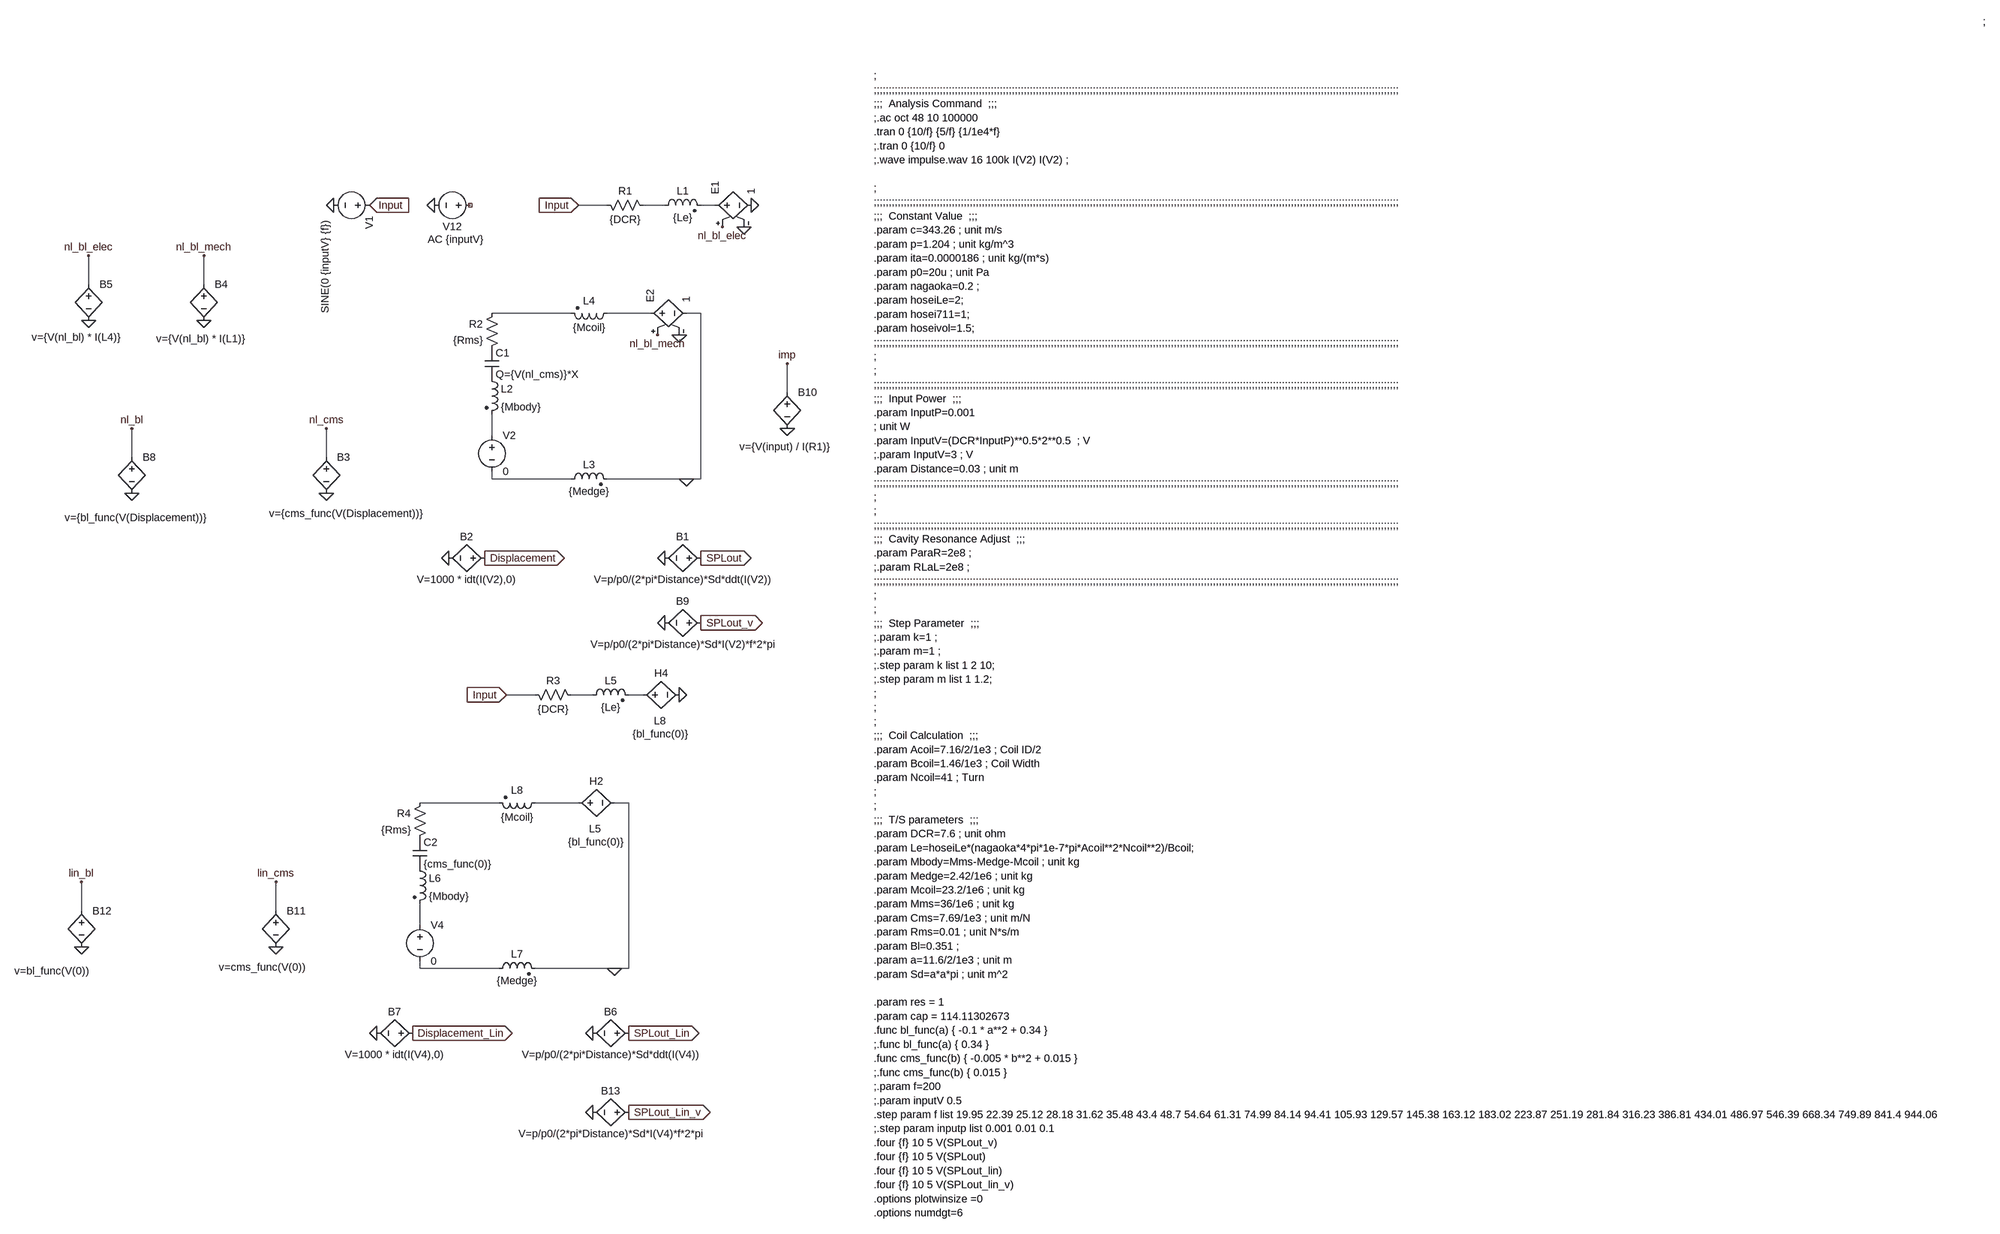
[diagram p0: schematic demo_11_01mw.asc]
demo_11_01mw.asc, the LTspice schematic file:
Version 4
SHEET 1 6896 9720
WIRE -2672 -416 -2736 -416
WIRE -2544 -416 -2592 -416
WIRE -2432 -416 -2464 -416
WIRE -3824 -240 -3824 -304
WIRE -3568 -240 -3568 -304
WIRE -2752 -176 -2928 -176
WIRE -2576 -176 -2672 -176
WIRE -2464 -176 -2496 -176
WIRE -2272 0 -2272 -64
WIRE -2928 96 -2928 48
WIRE -3728 144 -3728 80
WIRE -3296 144 -3296 80
WIRE -2928 192 -2928 176
WIRE -2752 192 -2928 192
WIRE -2496 192 -2672 192
WIRE -2464 192 -2464 -176
WIRE -2464 192 -2496 192
WIRE -2832 672 -2896 672
WIRE -2704 672 -2752 672
WIRE -2592 672 -2624 672
WIRE -2912 912 -3088 912
WIRE -2736 912 -2832 912
WIRE -2624 912 -2656 912
WIRE -3840 1152 -3840 1088
WIRE -3408 1152 -3408 1088
WIRE -3088 1184 -3088 1136
WIRE -3088 1280 -3088 1264
WIRE -2912 1280 -3088 1280
WIRE -2656 1280 -2832 1280
WIRE -2624 1280 -2624 912
WIRE -2624 1280 -2656 1280
FLAG -3056 -416 0
FLAG -3200 -416 Input
IOPIN -3200 -416 In
FLAG -2352 -416 0
FLAG -2736 -416 Input
IOPIN -2736 -416 In
FLAG -2496 192 0
FLAG -2464 368 SPLout
IOPIN -2464 368 Out
FLAG -2544 368 0
FLAG -2944 368 Displacement
IOPIN -2944 368 Out
FLAG -3024 368 0
FLAG -3280 -416 0
FLAG -3296 224 0
FLAG -3296 80 nl_cms
FLAG -3568 -160 0
FLAG -3568 -304 nl_bl_mech
FLAG -3824 -160 0
FLAG -3824 -304 nl_bl_elec
FLAG -2416 -368 nl_bl_elec
FLAG -2560 -128 nl_bl_mech
FLAG -2512 -128 0
FLAG -2368 -368 0
FLAG -2512 672 0
FLAG -2896 672 Input
IOPIN -2896 672 In
FLAG -2656 1280 0
FLAG -2624 1424 SPLout_Lin
IOPIN -2624 1424 Out
FLAG -2704 1424 0
FLAG -3104 1424 Displacement_Lin
IOPIN -3104 1424 Out
FLAG -3184 1424 0
FLAG -3728 224 0
FLAG -3728 80 nl_bl
FLAG -2464 512 SPLout_v
IOPIN -2464 512 Out
FLAG -2544 512 0
FLAG -2272 80 0
FLAG -2272 -64 imp
FLAG -3408 1232 0
FLAG -3408 1088 lin_cms
FLAG -3840 1232 0
FLAG -3840 1088 lin_bl
FLAG -2624 1600 SPLout_Lin_v
IOPIN -2624 1600 Out
FLAG -2704 1600 0
SYMBOL voltage -2960 -416 R90
WINDOW 0 32 56 VTop 2
WINDOW 3 -32 56 VBottom 2
WINDOW 123 60 48 VTop 2
SYMATTR InstName V12
SYMATTR Value ""
SYMATTR Value2 AC {inputV}
SYMBOL res -2688 -432 M90
WINDOW 0 0 56 VBottom 2
WINDOW 3 32 56 VTop 2
SYMATTR InstName R1
SYMATTR Value {DCR}
SYMBOL ind2 -2560 -400 R270
WINDOW 0 32 56 VTop 2
WINDOW 3 4 56 VBottom 2
SYMATTR InstName L1
SYMATTR Value {Le}
SYMATTR Type ind
SYMBOL res -2912 -192 M0
SYMATTR InstName R2
SYMATTR Value {Rms}
SYMBOL cap -2944 -96 R0
SYMATTR InstName C1
SYMATTR Value Q={V(nl_cms)}*X
SYMBOL h -2752 912 R270
WINDOW 0 32 56 VTop 2
WINDOW 3 -71 55 VBottom 2
WINDOW 38 -42 53 VBottom 2
SYMATTR InstName H2
SYMATTR Value {bl_func(0)}
SYMATTR SpiceModel L5
SYMBOL ind2 -2944 -48 R0
SYMATTR InstName L2
SYMATTR Value {Mbody}
SYMBOL voltage -2928 80 R0
SYMATTR InstName V2
SYMATTR Value 0
SYMBOL ind2 -2768 208 R270
WINDOW 0 32 56 VTop 2
WINDOW 3 4 56 VBottom 2
SYMATTR InstName L3
SYMATTR Value {Medge}
SYMBOL ind2 -2656 -192 R90
WINDOW 0 4 56 VBottom 2
WINDOW 3 32 56 VTop 2
SYMATTR InstName L4
SYMATTR Value {Mcoil}
SYMBOL bv -2448 368 R90
WINDOW 0 -32 56 VBottom 2
WINDOW 3 32 56 VTop 2
SYMATTR InstName B1
SYMATTR Value V=p/p0/(2*pi*Distance)*Sd*ddt(I(V2))
SYMBOL bv -2928 368 R90
WINDOW 0 -32 56 VBottom 2
WINDOW 3 32 56 VTop 2
SYMATTR InstName B2
SYMATTR Value V=1000 * idt(I(V2),0)
SYMBOL h -2608 672 R270
WINDOW 0 32 56 VTop 2
WINDOW 3 -71 55 VBottom 2
WINDOW 38 -42 53 VBottom 2
SYMATTR InstName H4
SYMATTR Value {bl_func(0)}
SYMATTR SpiceModel L8
SYMBOL voltage -3184 -416 R90
WINDOW 3 33 114 Left 2
WINDOW 123 24 38 Left 2
SYMATTR Value SINE(0 {inputV} {f})
SYMATTR InstName V1
SYMBOL bv -3296 128 R0
WINDOW 3 -127 141 Left 2
SYMATTR Value v={cms_func(V(Displacement))}
SYMATTR InstName B3
SYMBOL bv -3568 -256 R0
WINDOW 3 -106 137 Left 2
SYMATTR Value v={V(nl_bl) * I(L1)}
SYMATTR InstName B4
SYMBOL bv -3824 -256 R0
WINDOW 3 -127 133 Left 2
SYMATTR Value v={V(nl_bl) * I(L4)}
SYMATTR InstName B5
SYMBOL e -2448 -416 R270
SYMATTR InstName E1
SYMATTR Value 1
SYMBOL e -2592 -176 R270
SYMATTR InstName E2
SYMATTR Value 1
SYMBOL res -2848 656 M90
WINDOW 0 0 56 VBottom 2
WINDOW 3 32 56 VTop 2
SYMATTR InstName R3
SYMATTR Value {DCR}
SYMBOL ind2 -2720 688 R270
WINDOW 0 32 56 VTop 2
WINDOW 3 4 56 VBottom 2
SYMATTR InstName L5
SYMATTR Value {Le}
SYMATTR Type ind
SYMBOL res -3072 896 M0
SYMATTR InstName R4
SYMATTR Value {Rms}
SYMBOL cap -3104 992 R0
SYMATTR InstName C2
SYMATTR Value {cms_func(0)}
SYMBOL ind2 -3104 1040 R0
SYMATTR InstName L6
SYMATTR Value {Mbody}
SYMBOL voltage -3088 1168 R0
SYMATTR InstName V4
SYMATTR Value 0
SYMBOL ind2 -2928 1296 R270
WINDOW 0 32 56 VTop 2
WINDOW 3 4 56 VBottom 2
SYMATTR InstName L7
SYMATTR Value {Medge}
SYMBOL ind2 -2816 896 R90
WINDOW 0 4 56 VBottom 2
WINDOW 3 32 56 VTop 2
SYMATTR InstName L8
SYMATTR Value {Mcoil}
SYMBOL bv -2608 1424 R90
WINDOW 0 -32 56 VBottom 2
WINDOW 3 32 56 VTop 2
SYMATTR InstName B6
SYMATTR Value V=p/p0/(2*pi*Distance)*Sd*ddt(I(V4))
SYMBOL bv -3088 1424 R90
WINDOW 0 -32 56 VBottom 2
WINDOW 3 32 56 VTop 2
SYMATTR InstName B7
SYMATTR Value V=1000 * idt(I(V4),0)
SYMBOL bv -3728 128 R0
WINDOW 3 -149 150 Left 2
SYMATTR Value v={bl_func(V(Displacement))}
SYMATTR InstName B8
SYMBOL bv -2448 512 R90
WINDOW 0 -32 56 VBottom 2
WINDOW 3 32 56 VTop 2
SYMATTR InstName B9
SYMATTR Value V=p/p0/(2*pi*Distance)*Sd*I(V2)*f*2*pi
SYMBOL bv -2272 -16 R0
WINDOW 3 -106 137 Left 2
SYMATTR Value v={V(input) / I(R1)}
SYMATTR InstName B10
SYMBOL bv -3408 1136 R0
WINDOW 3 -127 141 Left 2
SYMATTR Value v=cms_func(V(0))
SYMATTR InstName B11
SYMBOL bv -3840 1136 R0
WINDOW 3 -149 150 Left 2
SYMATTR Value v=bl_func(V(0))
SYMATTR InstName B12
SYMBOL bv -2608 1600 R90
WINDOW 0 -32 56 VBottom 2
WINDOW 3 32 56 VTop 2
SYMATTR InstName B13
SYMATTR Value V=p/p0/(2*pi*Distance)*Sd*I(V4)*f*2*pi
TEXT -2080 -704 Left 2 !;\n;;;;;;;;;;;;;;;;;;;;;;;;;;;;;;;;;;;;;;;;;;;;;;;;;;;;;;;;;;;;;;;;;;;;;;;;;;;;;;;;;;;;;;;;;;;;;;;;;;;;;;;;;;;;;;;;;;;;;;;;;;;;;;;;;;;;;;;;;;;;;;;;;;;;;;;;;;;;;;;;;;;;;;;;;;;;;;;\n;;;  Analysis Command  ;;;\n;.ac oct 48 10 100000\n.tran 0 {10/f} {5/f} {1/1e4*f}\n;.tran 0 {10/f} 0\n;.wave impulse.wav 16 100k I(V2) I(V2) ;\n \n;\n;;;;;;;;;;;;;;;;;;;;;;;;;;;;;;;;;;;;;;;;;;;;;;;;;;;;;;;;;;;;;;;;;;;;;;;;;;;;;;;;;;;;;;;;;;;;;;;;;;;;;;;;;;;;;;;;;;;;;;;;;;;;;;;;;;;;;;;;;;;;;;;;;;;;;;;;;;;;;;;;;;;;;;;;;;;;;;;\n;;;  Constant Value  ;;;\n.param c=343.26 ; unit m/s\n.param p=1.204 ; unit kg/m^3\n.param ita=0.0000186 ; unit kg/(m*s)\n.param p0=20u ; unit Pa\n.param nagaoka=0.2 ; \n.param hoseiLe=2;\n.param hosei711=1;\n.param hoseivol=1.5;\n;;;;;;;;;;;;;;;;;;;;;;;;;;;;;;;;;;;;;;;;;;;;;;;;;;;;;;;;;;;;;;;;;;;;;;;;;;;;;;;;;;;;;;;;;;;;;;;;;;;;;;;;;;;;;;;;;;;;;;;;;;;;;;;;;;;;;;;;;;;;;;;;;;;;;;;;;;;;;;;;;;;;;;;;;;;;;;;\n;\n;\n;;;;;;;;;;;;;;;;;;;;;;;;;;;;;;;;;;;;;;;;;;;;;;;;;;;;;;;;;;;;;;;;;;;;;;;;;;;;;;;;;;;;;;;;;;;;;;;;;;;;;;;;;;;;;;;;;;;;;;;;;;;;;;;;;;;;;;;;;;;;;;;;;;;;;;;;;;;;;;;;;;;;;;;;;;;;;;;\n;;;  Input Power  ;;;\n.param InputP=0.001 \n; unit W\n.param InputV=(DCR*InputP)**0.5*2**0.5  ; V\n;.param InputV=3 ; V\n.param Distance=0.03 ; unit m\n;;;;;;;;;;;;;;;;;;;;;;;;;;;;;;;;;;;;;;;;;;;;;;;;;;;;;;;;;;;;;;;;;;;;;;;;;;;;;;;;;;;;;;;;;;;;;;;;;;;;;;;;;;;;;;;;;;;;;;;;;;;;;;;;;;;;;;;;;;;;;;;;;;;;;;;;;;;;;;;;;;;;;;;;;;;;;;;\n;\n;\n;;;;;;;;;;;;;;;;;;;;;;;;;;;;;;;;;;;;;;;;;;;;;;;;;;;;;;;;;;;;;;;;;;;;;;;;;;;;;;;;;;;;;;;;;;;;;;;;;;;;;;;;;;;;;;;;;;;;;;;;;;;;;;;;;;;;;;;;;;;;;;;;;;;;;;;;;;;;;;;;;;;;;;;;;;;;;;;\n;;;  Cavity Resonance Adjust  ;;;\n.param ParaR=2e8 ;\n;.param RLaL=2e8 ;\n;;;;;;;;;;;;;;;;;;;;;;;;;;;;;;;;;;;;;;;;;;;;;;;;;;;;;;;;;;;;;;;;;;;;;;;;;;;;;;;;;;;;;;;;;;;;;;;;;;;;;;;;;;;;;;;;;;;;;;;;;;;;;;;;;;;;;;;;;;;;;;;;;;;;;;;;;;;;;;;;;;;;;;;;;;;;;;;\n;\n;\n;;;  Step Parameter  ;;;\n;.param k=1 ;\n;.param m=1 ;\n;.step param k list 1 2 10;\n;.step param m list 1 1.2;\n;\n;\n;\n;;;  Coil Calculation  ;;;\n.param Acoil=7.16/2/1e3 ; Coil ID/2\n.param Bcoil=1.46/1e3 ; Coil Width\n.param Ncoil=41 ; Turn\n;\n;\n;;;  T/S parameters  ;;;\n.param DCR=7.6 ; unit ohm\n.param Le=hoseiLe*(nagaoka*4*pi*1e-7*pi*Acoil**2*Ncoil**2)/Bcoil; \n.param Mbody=Mms-Medge-Mcoil ; unit kg\n.param Medge=2.42/1e6 ; unit kg\n.param Mcoil=23.2/1e6 ; unit kg\n.param Mms=36/1e6 ; unit kg\n.param Cms=7.69/1e3 ; unit m/N\n.param Rms=0.01 ; unit N*s/m\n.param Bl=0.351 ;\n.param a=11.6/2/1e3 ; unit m\n.param Sd=a*a*pi ; unit m^2\n \n.param res = 1\n.param cap = 114.11302673\n.func bl_func(a) { -0.1 * a**2 + 0.34 }\n;.func bl_func(a) { 0.34 }\n.func cms_func(b) { -0.005 * b**2 + 0.015 }\n;.func cms_func(b) { 0.015 }\n;.param f=200\n;.param inputV 0.5\n.step param f list 19.95 22.39 25.12 28.18 31.62 35.48 43.4 48.7 54.64 61.31 74.99 84.14 94.41 105.93 129.57 145.38 163.12 183.02 223.87 251.19 281.84 316.23 386.81 434.01 486.97 546.39 668.34 749.89 841.4 944.06\n;.step param inputp list 0.001 0.01 0.1\n.four {f} 10 5 V(SPLout_v)\n.four {f} 10 5 V(SPLout)\n.four {f} 10 5 V(SPLout_lin)\n.four {f} 10 5 V(SPLout_lin_v) \n.options plotwinsize =0\n.options numdgt=6
TEXT 2064 -1288 Left 2 !;

The netlist it stands for:
* demo_11_01mw.asc
V12 NC_01 0 AC {inputV}
R1 Input N001 {DCR}
L1 N001 N002 {Le}
R2 N003 P001 {Rms}
C1 P001 P002 Q={V(nl_cms)}*X
H2 N010 0 L5 {bl_func(0)}
L2 P002 N005 {Mbody}
V2 N005 N006 0
L3 N006 0 {Medge}
L4 N004 N003 {Mcoil}
B1 SPLout 0 V=p/p0/(2*pi*Distance)*Sd*ddt(I(V2))
B2 Displacement 0 V=1000 * idt(I(V2),0)
H4 N008 0 L8 {bl_func(0)}
V1 Input 0 SINE(0 {inputV} {f})
B3 nl_cms 0 v={cms_func(V(Displacement))}
B4 nl_bl_mech 0 v={V(nl_bl) * I(L1)}
B5 nl_bl_elec 0 v={V(nl_bl) * I(L4)}
E1 N002 0 nl_bl_elec 0 1
E2 N004 0 nl_bl_mech 0 1
R3 Input N007 {DCR}
L5 N007 N008 {Le}
R4 N009 P003 {Rms}
C2 P003 P004 {cms_func(0)}
L6 P004 N011 {Mbody}
V4 N011 N012 0
L7 N012 0 {Medge}
L8 N010 N009 {Mcoil}
B6 SPLout_Lin 0 V=p/p0/(2*pi*Distance)*Sd*ddt(I(V4))
B7 Displacement_Lin 0 V=1000 * idt(I(V4),0)
B8 nl_bl 0 v={bl_func(V(Displacement))}
B9 SPLout_v 0 V=p/p0/(2*pi*Distance)*Sd*I(V2)*f*2*pi
B10 imp 0 v={V(input) / I(R1)}
B11 lin_cms 0 v=cms_func(V(0))
B12 lin_bl 0 v=bl_func(V(0))
B13 SPLout_Lin_v 0 V=p/p0/(2*pi*Distance)*Sd*I(V4)*f*2*pi
;
;;;;;;;;;;;;;;;;;;;;;;;;;;;;;;;;;;;;;;;;;;;;;;;;;;;;;;;;;;;;;;;;;;;;;;;;;;;;;;;;;;;;;;;;;;;;;;;;;;;;;;;;;;;;;;;;;;;;;;;;;;;;;;;;;;;;;;;;;;;;;;;;;;;;;;;;;;;;;;;;;;;;;;;;;;;;;;;
;;;  Analysis Command  ;;;
;.ac oct 48 10 100000
.tran 0 {10/f} {5/f} {1/1e4*f}
;.tran 0 {10/f} 0
;.wave impulse.wav 16 100k I(V2) I(V2) ;
;
;;;;;;;;;;;;;;;;;;;;;;;;;;;;;;;;;;;;;;;;;;;;;;;;;;;;;;;;;;;;;;;;;;;;;;;;;;;;;;;;;;;;;;;;;;;;;;;;;;;;;;;;;;;;;;;;;;;;;;;;;;;;;;;;;;;;;;;;;;;;;;;;;;;;;;;;;;;;;;;;;;;;;;;;;;;;;;;
;;;  Constant Value  ;;;
.param c=343.26 ; unit m/s
.param p=1.204 ; unit kg/m^3
.param ita=0.0000186 ; unit kg/(m*s)
.param p0=20u ; unit Pa
.param nagaoka=0.2 ;
.param hoseiLe=2;
.param hosei711=1;
.param hoseivol=1.5;
;;;;;;;;;;;;;;;;;;;;;;;;;;;;;;;;;;;;;;;;;;;;;;;;;;;;;;;;;;;;;;;;;;;;;;;;;;;;;;;;;;;;;;;;;;;;;;;;;;;;;;;;;;;;;;;;;;;;;;;;;;;;;;;;;;;;;;;;;;;;;;;;;;;;;;;;;;;;;;;;;;;;;;;;;;;;;;;
;
;
;;;;;;;;;;;;;;;;;;;;;;;;;;;;;;;;;;;;;;;;;;;;;;;;;;;;;;;;;;;;;;;;;;;;;;;;;;;;;;;;;;;;;;;;;;;;;;;;;;;;;;;;;;;;;;;;;;;;;;;;;;;;;;;;;;;;;;;;;;;;;;;;;;;;;;;;;;;;;;;;;;;;;;;;;;;;;;;
;;;  Input Power  ;;;
.param InputP=0.001
; unit W
.param InputV=(DCR*InputP)**0.5*2**0.5  ; V
;.param InputV=3 ; V
.param Distance=0.03 ; unit m
;;;;;;;;;;;;;;;;;;;;;;;;;;;;;;;;;;;;;;;;;;;;;;;;;;;;;;;;;;;;;;;;;;;;;;;;;;;;;;;;;;;;;;;;;;;;;;;;;;;;;;;;;;;;;;;;;;;;;;;;;;;;;;;;;;;;;;;;;;;;;;;;;;;;;;;;;;;;;;;;;;;;;;;;;;;;;;;
;
;
;;;;;;;;;;;;;;;;;;;;;;;;;;;;;;;;;;;;;;;;;;;;;;;;;;;;;;;;;;;;;;;;;;;;;;;;;;;;;;;;;;;;;;;;;;;;;;;;;;;;;;;;;;;;;;;;;;;;;;;;;;;;;;;;;;;;;;;;;;;;;;;;;;;;;;;;;;;;;;;;;;;;;;;;;;;;;;;
;;;  Cavity Resonance Adjust  ;;;
.param ParaR=2e8 ;
;.param RLaL=2e8 ;
;;;;;;;;;;;;;;;;;;;;;;;;;;;;;;;;;;;;;;;;;;;;;;;;;;;;;;;;;;;;;;;;;;;;;;;;;;;;;;;;;;;;;;;;;;;;;;;;;;;;;;;;;;;;;;;;;;;;;;;;;;;;;;;;;;;;;;;;;;;;;;;;;;;;;;;;;;;;;;;;;;;;;;;;;;;;;;;
;
;
;;;  Step Parameter  ;;;
;.param k=1 ;
;.param m=1 ;
;.step param k list 1 2 10;
;.step param m list 1 1.2;
;
;
;
;;;  Coil Calculation  ;;;
.param Acoil=7.16/2/1e3 ; Coil ID/2
.param Bcoil=1.46/1e3 ; Coil Width
.param Ncoil=41 ; Turn
;
;
;;;  T/S parameters  ;;;
.param DCR=7.6 ; unit ohm
.param Le=hoseiLe*(nagaoka*4*pi*1e-7*pi*Acoil**2*Ncoil**2)/Bcoil;
.param Mbody=Mms-Medge-Mcoil ; unit kg
.param Medge=2.42/1e6 ; unit kg
.param Mcoil=23.2/1e6 ; unit kg
.param Mms=36/1e6 ; unit kg
.param Cms=7.69/1e3 ; unit m/N
.param Rms=0.01 ; unit N*s/m
.param Bl=0.351 ;
.param a=11.6/2/1e3 ; unit m
.param Sd=a*a*pi ; unit m^2
.param res = 1
.param cap = 114.11302673
.func bl_func(a) { -0.1 * a**2 + 0.34 }
;.func bl_func(a) { 0.34 }
.func cms_func(b) { -0.005 * b**2 + 0.015 }
;.func cms_func(b) { 0.015 }
;.param f=200
;.param inputV 0.5
.step param f list 19.95 22.39 25.12 28.18 31.62 35.48 43.4 48.7 54.64 61.31 74.99 84.14 94.41 105.93 129.57 145.38 163.12 183.02 223.87 251.19 281.84 316.23 386.81 434.01 486.97 546.39 668.34 749.89 841.4 944.06
;.step param inputp list 0.001 0.01 0.1
.four {f} 10 5 V(SPLout_v)
.four {f} 10 5 V(SPLout)
.four {f} 10 5 V(SPLout_lin)
.four {f} 10 5 V(SPLout_lin_v)
.options plotwinsize =0
.options numdgt=6
;
.backanno
.end

* Results of the author's LTspice run, read from the files saved beside the schematic
* From the log:
*   N-Period=5
*   Fourier components of V(splout_v)
*   DC component:-1.98362e-005
*   Harmonic  Frequency   Fourier   Normalized   Phase    Normalized
*    Number     [Hz]     Component   Component  [degree]  Phase [deg]
*       1     1.995e+01  4.406e+01  1.000e+00     87.01°      0.00°
*       2     3.990e+01  6.856e-04  1.556e-05    171.02°     84.01°
*       3     5.985e+01  1.221e-01  2.771e-03     68.98°    -18.03°
*       4     7.980e+01  7.548e-05  1.713e-06   -168.51°   -255.52°
*       5     9.975e+01  4.004e-02  9.087e-04     63.34°    -23.68°
*       6     1.197e+02  1.090e-04  2.474e-06    -71.44°   -158.46°
*       7     1.397e+02  3.016e-02  6.845e-04   -141.95°   -228.96°
*       8     1.596e+02  8.949e-05  2.031e-06   -156.08°   -243.10°
*       9     1.795e+02  4.106e-03  9.319e-05    -10.90°    -97.91°
*      10     1.995e+02  1.248e-04  2.833e-06   -176.53°   -263.54°
*   Total Harmonic Distortion: 0.299648%(0.297137%)
*   N-Period=5
*   Fourier components of V(splout)
*   DC component:0.000161727
*   Harmonic  Frequency   Fourier   Normalized   Phase    Normalized
*    Number     [Hz]     Component   Component  [degree]  Phase [deg]
*       1     1.995e+01  4.405e+01  1.000e+00    176.68°      0.00°
*       2     3.990e+01  1.054e-03  2.392e-05   -102.39°   -279.06°
*       3     5.985e+01  3.581e-01  8.128e-03    157.75°    -18.93°
*       4     7.980e+01  6.816e-05  1.547e-06     19.51°   -157.16°
*       5     9.975e+01  1.911e-01  4.338e-03    163.23°    -13.45°
*       6     1.197e+02  8.203e-04  1.862e-05     38.50°   -138.17°
*       7     1.397e+02  2.183e-01  4.955e-03    -55.47°   -232.15°
*       8     1.596e+02  4.506e-04  1.023e-05    -51.23°   -227.90°
*       9     1.795e+02  1.573e-02  3.571e-04     62.29°   -114.39°
*      10     1.995e+02  9.287e-04  2.108e-05    -89.09°   -265.76°
*   Total Harmonic Distortion: 1.046720%(1.150093%)
*   N-Period=5
*   Fourier components of V(splout_lin)
*   DC component:-1.17515e-005
*   Harmonic  Frequency   Fourier   Normalized   Phase    Normalized
*    Number     [Hz]     Component   Component  [degree]  Phase [deg]
*       1     1.995e+01  4.418e+01  1.000e+00    176.67°      0.00°
*       2     3.990e+01  2.738e-05  6.197e-07    -66.26°   -242.92°
*       3     5.985e+01  1.618e-02  3.661e-04     39.86°   -136.80°
*       4     7.980e+01  3.876e-05  8.772e-07    -53.06°   -229.73°
*       5     9.975e+01  4.894e-02  1.108e-03   -105.67°   -282.34°
*       6     1.197e+02  5.845e-05  1.323e-06    -50.96°   -227.62°
*       7     1.397e+02  1.472e-02  3.332e-04   -118.46°   -295.13°
*       8     1.596e+02  8.991e-05  2.035e-06    -60.84°   -237.51°
*       9     1.795e+02  2.826e-02  6.397e-04    -51.18°   -227.84°
*      10     1.995e+02  1.234e-04  2.792e-06    -86.26°   -262.93°
*   Total Harmonic Distortion: 0.137162%(0.203117%)
*   N-Period=5
*   Fourier components of V(splout_lin_v)
*   DC component:-2.62354e-006
*   Harmonic  Frequency   Fourier   Normalized   Phase    Normalized
*    Number     [Hz]     Component   Component  [degree]  Phase [deg]
*       1     1.995e+01  4.419e+01  1.000e+00     87.01°      0.00°
*       2     3.990e+01  5.377e-06  1.217e-07    -98.40°   -185.41°
*       3     5.985e+01  4.535e-03  1.026e-04    -21.74°   -108.74°
*       4     7.980e+01  5.933e-06  1.343e-07   -107.00°   -194.01°
*       5     9.975e+01  2.262e-03  5.120e-05    137.40°     50.40°
*       6     1.197e+02  6.968e-06  1.577e-07   -119.16°   -206.16°
*       7     1.397e+02  1.045e-03  2.364e-05    121.83°     34.83°
*       8     1.596e+02  8.617e-06  1.950e-07   -139.31°   -226.31°
*       9     1.795e+02  2.105e-03  4.764e-05    -97.30°   -184.31°
*      10     1.995e+02  9.962e-06  2.254e-07   -172.81°   -259.81°
*   Total Harmonic Distortion: 0.012642%(0.000000%)
*   N-Period=5
*   Fourier components of V(splout_v)
*   DC component:-0.000218838
*   Harmonic  Frequency   Fourier   Normalized   Phase    Normalized
*    Number     [Hz]     Component   Component  [degree]  Phase [deg]
*       1     2.239e+01  5.563e+01  1.000e+00     86.65°      0.00°
*       2     4.478e+01  1.956e-04  3.516e-06    151.75°     65.09°
*       3     6.717e+01  1.351e-01  2.429e-03     68.76°    -17.90°
*       4     8.956e+01  8.754e-04  1.574e-05    119.68°     33.03°
*       5     1.120e+02  5.858e-02  1.053e-03     51.22°    -35.44°
*       6     1.343e+02  2.549e-04  4.582e-06    165.01°     78.36°
*       7     1.567e+02  4.602e-02  8.272e-04   -150.57°   -237.22°
*       8     1.791e+02  1.541e-03  2.771e-05    -79.94°   -166.60°
*       9     2.015e+02  3.761e-02  6.761e-04    164.71°     78.06°
*      10     2.239e+02  5.154e-04  9.265e-06    -64.57°   -151.22°
*   Total Harmonic Distortion: 0.285509%(0.286521%)
*   N-Period=5
*   Fourier components of V(splout)
*   DC component:0.000382053
*   Harmonic  Frequency   Fourier   Normalized   Phase    Normalized
*    Number     [Hz]     Component   Component  [degree]  Phase [deg]
*       1     2.239e+01  5.562e+01  1.000e+00    176.38°      0.00°
*       2     4.478e+01  5.385e-04  9.681e-06    168.81°     -7.57°
*       3     6.717e+01  4.002e-01  7.195e-03    156.99°    -19.39°
*       4     8.956e+01  3.224e-03  5.796e-05   -154.89°   -331.27°
*       5     1.120e+02  2.743e-01  4.931e-03    147.86°    -28.52°
*       6     1.343e+02  9.199e-04  1.654e-05   -116.23°   -292.60°
*       7     1.567e+02  3.301e-01  5.935e-03    -63.59°   -239.96°
*       8     1.791e+02  1.190e-02  2.140e-04     10.88°   -165.50°
*       9     2.015e+02  3.562e-01  6.405e-03   -107.10°   -283.47°
*      10     2.239e+02  5.082e-03  9.137e-05     23.87°   -152.51°
*   Total Harmonic Distortion: 1.234445%(1.422140%)
*   N-Period=5
*   Fourier components of V(splout_lin)
*   DC component:0.000477115
*   Harmonic  Frequency   Fourier   Normalized   Phase    Normalized
*    Number     [Hz]     Component   Component  [degree]  Phase [deg]
*       1     2.239e+01  5.576e+01  1.000e+00    176.36°      0.00°
*       2     4.478e+01  8.329e-04  1.494e-05    111.63°    -64.74°
*       3     6.717e+01  2.152e-02  3.859e-04     53.66°   -122.71°
*       4     8.956e+01  5.997e-04  1.075e-05     91.54°    -84.82°
*       5     1.120e+02  5.000e-02  8.967e-04   -106.46°   -282.82°
*       6     1.343e+02  6.842e-04  1.227e-05     78.43°    -97.93°
*       7     1.567e+02  2.482e-02  4.452e-04   -132.90°   -309.26°
*       8     1.791e+02  9.356e-04  1.678e-05     92.46°    -83.90°
*       9     2.015e+02  2.785e-02  4.995e-04    -58.63°   -234.99°
*      10     2.239e+02  9.754e-04  1.749e-05     73.72°   -102.64°
*   Total Harmonic Distortion: 0.118402%(0.172570%)
*   N-Period=5
*   Fourier components of V(splout_lin_v)
*   DC component:-2.04045e-005
*   Harmonic  Frequency   Fourier   Normalized   Phase    Normalized
*    Number     [Hz]     Component   Component  [degree]  Phase [deg]
*       1     2.239e+01  5.576e+01  1.000e+00     86.64°      0.00°
*       2     4.478e+01  2.933e-05  5.260e-07      3.04°    -83.59°
*       3     6.717e+01  4.800e-03  8.607e-05    -26.01°   -112.65°
*       4     8.956e+01  2.787e-05  4.997e-07     86.93°      0.30°
*       5     1.120e+02  1.553e-03  2.785e-05    131.50°     44.86°
*       6     1.343e+02  3.916e-05  7.023e-07   -149.60°   -236.24°
*       7     1.567e+02  2.257e-03  4.047e-05    107.14°     20.50°
*       8     1.791e+02  4.787e-05  8.585e-07    -67.51°   -154.15°
*       9     2.015e+02  2.054e-03  3.683e-05   -123.00°   -209.64°
*      10     2.239e+02  6.245e-05  1.120e-06    -35.72°   -122.36°
*   Total Harmonic Distortion: 0.010574%(0.000000%)
*   N-Period=5
*   Fourier components of V(splout_v)
*   DC component:-1.01964e-005
*   Harmonic  Frequency   Fourier   Normalized   Phase    Normalized
*    Number     [Hz]     Component   Component  [degree]  Phase [deg]
*       1     2.512e+01  7.024e+01  1.000e+00     86.23°      0.00°
*       2     5.024e+01  1.675e-04  2.385e-06    -56.60°   -142.83°
*       3     7.536e+01  1.184e-01  1.686e-03     60.94°    -25.29°
*       4     1.005e+02  1.030e-04  1.466e-06    -57.41°   -143.64°
*       5     1.256e+02  2.774e-02  3.949e-04     55.53°    -30.70°
*       6     1.507e+02  9.672e-05  1.377e-06   -151.04°   -237.27°
*       7     1.758e+02  7.693e-03  1.095e-04      6.13°    -80.11°
*       8     2.010e+02  2.083e-04  2.965e-06   -124.09°   -210.32°
*       9     2.261e+02  3.517e-02  5.007e-04    132.03°     45.79°
*      10     2.512e+02  4.627e-05  6.588e-07   -171.86°   -258.09°
*   Total Harmonic Distortion: 0.180555%(0.173642%)
*   N-Period=5
*   Fourier components of V(splout)
*   DC component:0.000170199
*   Harmonic  Frequency   Fourier   Normalized   Phase    Normalized
*    Number     [Hz]     Component   Component  [degree]  Phase [deg]
*       1     2.512e+01  7.024e+01  1.000e+00    176.01°      0.00°
*       2     5.024e+01  6.018e-04  8.568e-06     61.51°   -114.49°
*       3     7.536e+01  3.566e-01  5.077e-03    147.49°    -28.52°
*       4     1.005e+02  6.766e-04  9.632e-06     57.50°   -118.51°
*       5     1.256e+02  1.258e-01  1.790e-03    163.16°    -12.85°
*       6     1.507e+02  3.326e-04  4.735e-06    -33.04°   -209.05°
*       7     1.758e+02  3.359e-02  4.782e-04    108.69°    -67.31°
*       8     2.010e+02  1.511e-03  2.151e-05    -24.91°   -200.92°
*       9     2.261e+02  3.228e-01  4.596e-03   -138.30°   -314.31°
*      10     2.512e+02  1.310e-04  1.865e-06    -61.27°   -237.28°
*   Total Harmonic Distortion: 0.709443%(0.740877%)
*   N-Period=5
*   Fourier components of V(splout_lin)
*   DC component:2.25073e-005
*   Harmonic  Frequency   Fourier   Normalized   Phase    Normalized
*    Number     [Hz]     Component   Component  [degree]  Phase [deg]
*       1     2.512e+01  7.036e+01  1.000e+00    176.00°      0.00°
*       2     5.024e+01  5.455e-05  7.754e-07     75.40°   -100.60°
*       3     7.536e+01  3.162e-02  4.495e-04     63.67°   -112.32°
*       4     1.005e+02  7.030e-05  9.992e-07     58.07°   -117.92°
*       5     1.256e+02  4.720e-02  6.709e-04   -102.09°   -278.08°
*       6     1.507e+02  8.178e-05  1.162e-06     28.20°   -147.80°
*       7     1.758e+02  3.939e-02  5.598e-04   -138.05°   -314.05°
*       8     2.010e+02  8.927e-05  1.269e-06    -15.39°   -191.39°
*       9     2.261e+02  1.331e-02  1.891e-04    -68.90°   -244.89°
*      10     2.512e+02  6.818e-05  9.691e-07    -55.67°   -231.67°
*   Total Harmonic Distortion: 0.100063%(0.147258%)
*   N-Period=5
*   Fourier components of V(splout_lin_v)
*   DC component:-3.04745e-006
*   Harmonic  Frequency   Fourier   Normalized   Phase    Normalized
*    Number     [Hz]     Component   Component  [degree]  Phase [deg]
*       1     2.512e+01  7.036e+01  1.000e+00     86.22°      0.00°
*       2     5.024e+01  6.371e-06  9.055e-08    -91.91°   -178.13°
*       3     7.536e+01  4.906e-03  6.973e-05    -27.50°   -113.72°
*       4     1.005e+02  8.209e-06  1.167e-07    -84.53°   -170.76°
*       5     1.256e+02  3.350e-04  4.761e-06    124.54°     38.32°
*       6     1.507e+02  1.149e-05  1.633e-07    -94.60°   -180.82°
*       7     1.758e+02  3.401e-03  4.833e-05     97.62°     11.39°
*       8     2.010e+02  1.336e-05  1.899e-07   -128.19°   -214.42°
*       9     2.261e+02  6.060e-04  8.613e-06   -145.13°   -231.36°
*      10     2.512e+02  1.122e-05  1.595e-07   -163.50°   -249.72°
*   Total Harmonic Distortion: 0.008542%(0.000000%)
*   N-Period=5
*   Fourier components of V(splout_v)
*   DC component:-1.70852e-005
*   Harmonic  Frequency   Fourier   Normalized   Phase    Normalized
*    Number     [Hz]     Component   Component  [degree]  Phase [deg]
*       1     2.818e+01  8.869e+01  1.000e+00     85.76°      0.00°
*       2     5.636e+01  5.691e-04  6.417e-06    -22.34°   -108.11°
*       3     8.454e+01  1.445e-01  1.629e-03     57.84°    -27.92°
*       4     1.127e+02  5.267e-05  5.939e-07   -163.77°   -249.53°
*       5     1.409e+02  2.964e-02  3.342e-04   -164.64°   -250.41°
*       6     1.691e+02  8.892e-05  1.003e-06   -139.92°   -225.68°
*       7     1.973e+02  4.070e-02  4.589e-04    -21.98°   -107.74°
*       8     2.254e+02  9.729e-05  1.097e-06    102.92°     17.16°
*       9     2.536e+02  2.757e-02  3.109e-04    107.49°     21.73°
*      10     2.818e+02  5.691e-05  6.417e-07    114.08°     28.32°
*   Total Harmonic Distortion: 0.175317%(0.174198%)
*   N-Period=5
*   Fourier components of V(splout)
*   DC component:-0.00011287
*   Harmonic  Frequency   Fourier   Normalized   Phase    Normalized
*    Number     [Hz]     Component   Component  [degree]  Phase [deg]
*       1     2.818e+01  8.869e+01  1.000e+00    175.60°      0.00°
*       2     5.636e+01  9.363e-04  1.056e-05     61.98°   -113.62°
*       3     8.454e+01  4.283e-01  4.830e-03    148.43°    -27.17°
*       4     1.127e+02  4.318e-04  4.869e-06    -82.99°   -258.59°
*       5     1.409e+02  1.698e-01  1.915e-03    -79.01°   -254.62°
*       6     1.691e+02  7.198e-04  8.117e-06    -62.33°   -237.93°
*       7     1.973e+02  2.782e-01  3.136e-03     66.38°   -109.22°
*       8     2.254e+02  8.583e-04  9.677e-06   -153.63°   -329.23°
*       9     2.536e+02  2.626e-01  2.961e-03   -159.98°   -335.58°
*      10     2.818e+02  6.897e-04  7.777e-06   -140.28°   -315.88°
*   Total Harmonic Distortion: 0.675245%(0.701841%)
*   N-Period=5
*   Fourier components of V(splout_lin)
*   DC component:1.95874e-005
*   Harmonic  Frequency   Fourier   Normalized   Phase    Normalized
*    Number     [Hz]     Component   Component  [degree]  Phase [deg]
*       1     2.818e+01  8.881e+01  1.000e+00    175.60°      0.00°
*       2     5.636e+01  4.241e-05  4.776e-07     63.08°   -112.52°
*       3     8.454e+01  5.885e-03  6.627e-05    -13.56°   -189.15°
*       4     1.127e+02  5.444e-05  6.130e-07     32.45°   -143.14°
*       5     1.409e+02  3.816e-02  4.297e-04   -123.46°   -299.05°
*       6     1.691e+02  8.101e-05  9.122e-07    -10.02°   -185.62°
*       7     1.973e+02  2.083e-02  2.346e-04    -38.63°   -214.22°
*       8     2.254e+02  9.217e-05  1.038e-06    -74.81°   -250.40°
*       9     2.536e+02  1.732e-02  1.950e-04   -135.07°   -310.67°
*      10     2.818e+02  6.290e-05  7.083e-07   -123.05°   -298.65°
*   Total Harmonic Distortion: 0.053110%(0.080831%)
*   N-Period=5
*   Fourier components of V(splout_lin_v)
*   DC component:-4.56876e-006
*   Harmonic  Frequency   Fourier   Normalized   Phase    Normalized
*    Number     [Hz]     Component   Component  [degree]  Phase [deg]
*       1     2.818e+01  8.881e+01  1.000e+00     85.75°      0.00°
*       2     5.636e+01  9.670e-06  1.089e-07    -93.55°   -179.30°
*       3     8.454e+01  3.591e-03  4.044e-05    -27.70°   -113.46°
*       4     1.127e+02  1.170e-05  1.317e-07   -101.33°   -187.08°
*       5     1.409e+02  3.787e-03  4.264e-05    124.51°     38.75°
*       6     1.691e+02  1.593e-05  1.794e-07   -122.89°   -208.64°
*       7     1.973e+02  2.445e-03  2.753e-05   -104.78°   -190.54°
*       8     2.254e+02  1.625e-05  1.830e-07   -168.32°   -254.07°
*       9     2.536e+02  9.066e-04  1.021e-05     30.92°    -54.84°
*      10     2.818e+02  9.794e-06  1.103e-07    160.89°     75.13°
*   Total Harmonic Distortion: 0.006569%(0.000000%)
*   N-Period=5
*   Fourier components of V(splout_v)
*   DC component:2.86031e-005
*   Harmonic  Frequency   Fourier   Normalized   Phase    Normalized
*    Number     [Hz]     Component   Component  [degree]  Phase [deg]
*       1     3.162e+01  1.121e+02  1.000e+00     85.23°      0.00°
*       2     6.324e+01  8.616e-04  7.687e-06    -17.97°   -103.20°
*       3     9.486e+01  1.806e-01  1.611e-03     55.54°    -29.69°
*       4     1.265e+02  8.393e-05  7.488e-07     51.45°    -33.78°
*       5     1.581e+02  2.677e-02  2.388e-04   -178.37°   -263.60°
*       6     1.897e+02  1.119e-04  9.981e-07    -46.44°   -131.67°
*       7     2.213e+02  3.248e-02  2.898e-04    -55.78°   -141.01°
*       8     2.530e+02  9.913e-05  8.845e-07    -57.00°   -142.23°
*       9     2.846e+02  1.789e-02  1.596e-04     83.63°     -1.60°
*      10     3.162e+02  6.292e-05  5.614e-07   -130.69°   -215.92°
*   Total Harmonic Distortion: 0.166235%(0.166775%)
*   N-Period=5
*   Fourier components of V(splout)
*   DC component:0.00019405
*   Harmonic  Frequency   Fourier   Normalized   Phase    Normalized
*    Number     [Hz]     Component   Component  [degree]  Phase [deg]
*       1     3.162e+01  1.121e+02  1.000e+00    175.13°      0.00°
*       2     6.324e+01  2.095e-03  1.869e-05     75.09°   -100.04°
*       3     9.486e+01  5.386e-01  4.806e-03    146.23°    -28.90°
*       4     1.265e+02  6.541e-04  5.836e-06    113.57°    -61.56°
*       5     1.581e+02  1.459e-01  1.301e-03    -90.21°   -265.34°
*       6     1.897e+02  9.780e-04  8.726e-06     59.78°   -115.35°
*       7     2.213e+02  2.207e-01  1.969e-03     31.43°   -143.70°
*       8     2.530e+02  1.053e-03  9.398e-06     50.43°   -124.70°
*       9     2.846e+02  1.629e-01  1.454e-03    175.98°      0.85°
*      10     3.162e+02  4.719e-04  4.210e-06     -3.80°   -178.93°
*   Total Harmonic Distortion: 0.554775%(0.571415%)
*   N-Period=5
*   Fourier components of V(splout_lin)
*   DC component:3.39299e-005
*   Harmonic  Frequency   Fourier   Normalized   Phase    Normalized
*    Number     [Hz]     Component   Component  [degree]  Phase [deg]
*       1     3.162e+01  1.122e+02  1.000e+00    175.12°      0.00°
*       2     6.324e+01  6.869e-05  6.121e-07     95.74°    -79.38°
*       3     9.486e+01  1.179e-02  1.050e-04   -106.67°   -281.79°
*       4     1.265e+02  7.392e-05  6.586e-07    102.82°    -72.30°
*       5     1.581e+02  1.357e-02  1.209e-04   -102.00°   -277.12°
*       6     1.897e+02  9.558e-05  8.516e-07    104.26°    -70.86°
*       7     2.213e+02  1.200e-02  1.069e-04    -98.56°   -273.68°
*       8     2.530e+02  1.010e-04  8.999e-07     89.14°    -85.98°
*       9     2.846e+02  8.160e-03  7.271e-05    -99.17°   -274.29°
*      10     3.162e+02  8.923e-05  7.950e-07     86.05°    -89.07°
*   Total Harmonic Distortion: 0.020586%(0.041100%)
*   N-Period=5
*   Fourier components of V(splout_lin_v)
*   DC component:1.2867e-006
*   Harmonic  Frequency   Fourier   Normalized   Phase    Normalized
*    Number     [Hz]     Component   Component  [degree]  Phase [deg]
*       1     3.162e+01  1.122e+02  1.000e+00     85.22°      0.00°
*       2     6.324e+01  2.834e-06  2.525e-08     85.37°      0.15°
*       3     9.486e+01  2.480e-04  2.209e-06    154.20°     68.98°
*       4     1.265e+02  3.692e-06  3.289e-08     74.54°    -10.68°
*       5     1.581e+02  2.818e-04  2.511e-06    176.31°     91.09°
*       6     1.897e+02  5.246e-06  4.674e-08     40.18°    -45.04°
*       7     2.213e+02  1.092e-04  9.731e-07   -179.77°   -264.99°
*       8     2.530e+02  4.103e-06  3.656e-08     -9.22°    -94.44°
*       9     2.846e+02  1.365e-04  1.216e-06    -48.98°   -134.20°
*      10     3.162e+02  2.266e-06  2.019e-08    -27.55°   -112.77°
*   Total Harmonic Distortion: 0.000369%(0.007524%)
*   N-Period=5
*   Fourier components of V(splout_v)
*   DC component:6.12002e-005
*   Harmonic  Frequency   Fourier   Normalized   Phase    Normalized
*    Number     [Hz]     Component   Component  [degree]  Phase [deg]
*       1     3.548e+01  1.418e+02  1.000e+00     84.62°      0.00°
*       2     7.096e+01  1.042e-03  7.353e-06    -17.10°   -101.73°
*       3     1.064e+02  2.773e-01  1.956e-03     49.37°    -35.25°
*       4     1.419e+02  3.345e-04  2.360e-06     86.23°      1.61°
*       5     1.774e+02  1.027e-01  7.242e-04    177.32°     92.70°
*       6     2.129e+02  1.589e-04  1.121e-06    -87.02°   -171.64°
*       7     2.484e+02  8.324e-02  5.871e-04    -69.83°   -154.45°
*       8     2.838e+02  2.033e-04  1.434e-06    -40.09°   -124.71°
*       9     3.193e+02  3.410e-02  2.405e-04     74.92°     -9.70°
*      10     3.548e+02  4.715e-05  3.326e-07    -51.80°   -136.42°
*   Total Harmonic Distortion: 0.217980%(0.217467%)
*   N-Period=5
*   Fourier components of V(splout)
*   DC component:2.36094e-005
*   Harmonic  Frequency   Fourier   Normalized   Phase    Normalized
*    Number     [Hz]     Component   Component  [degree]  Phase [deg]
*       1     3.548e+01  1.418e+02  1.000e+00    174.52°      0.00°
*       2     7.096e+01  2.151e-03  1.517e-05     72.93°   -101.59°
*       3     1.064e+02  8.290e-01  5.847e-03    139.28°    -35.24°
*       4     1.419e+02  1.374e-03  9.689e-06    173.23°     -1.30°
*       5     1.774e+02  5.383e-01  3.797e-03    -93.87°   -268.39°
*       6     2.129e+02  9.527e-04  6.720e-06      5.50°   -169.03°
*       7     2.484e+02  5.826e-01  4.109e-03     19.14°   -155.38°
*       8     2.838e+02  1.673e-03  1.180e-05     51.12°   -123.41°
*       9     3.193e+02  3.130e-01  2.207e-03    167.80°     -6.72°
*      10     3.548e+02  4.967e-04  3.504e-06     46.47°   -128.05°
*   Total Harmonic Distortion: 0.838854%(0.848170%)
*   N-Period=5
*   Fourier components of V(splout_lin)
*   DC component:0.000108172
*   Harmonic  Frequency   Fourier   Normalized   Phase    Normalized
*    Number     [Hz]     Component   Component  [degree]  Phase [deg]
*       1     3.548e+01  1.420e+02  1.000e+00    174.51°      0.00°
*       2     7.096e+01  2.704e-04  1.904e-06    101.88°    -72.63°
*       3     1.064e+02  9.719e-03  6.845e-05     29.34°   -145.17°
*       4     1.419e+02  4.762e-04  3.354e-06    105.48°    -69.03°
*       5     1.774e+02  3.976e-02  2.801e-04   -141.27°   -315.78°
*       6     2.129e+02  7.225e-04  5.089e-06     63.98°   -110.54°
*       7     2.484e+02  1.304e-02  9.185e-05    -70.08°   -244.59°
*       8     2.838e+02  4.369e-04  3.077e-06     27.69°   -146.82°
*       9     3.193e+02  1.917e-02  1.350e-04   -125.48°   -299.99°
*      10     3.548e+02  2.806e-04  1.977e-06     15.07°   -159.44°
*   Total Harmonic Distortion: 0.033142%(0.050941%)
*   N-Period=5
*   Fourier components of V(splout_lin_v)
*   DC component:1.936e-005
*   Harmonic  Frequency   Fourier   Normalized   Phase    Normalized
*    Number     [Hz]     Component   Component  [degree]  Phase [deg]
*       1     3.548e+01  1.420e+02  1.000e+00     84.61°      0.00°
*       2     7.096e+01  3.692e-05  2.600e-07     63.56°    -21.05°
*       3     1.064e+02  4.444e-03  3.130e-05    -36.17°   -120.79°
*       4     1.419e+02  6.142e-05  4.326e-07     24.22°    -60.40°
*       5     1.774e+02  4.620e-03  3.254e-05     96.55°     11.93°
*       6     2.129e+02  8.961e-05  6.312e-07    -35.82°   -120.43°
*       7     2.484e+02  1.171e-03  8.245e-06   -154.58°   -239.19°
*       8     2.838e+02  4.995e-05  3.518e-07    -94.82°   -179.44°
*       9     3.193e+02  8.372e-05  5.897e-07     32.45°    -52.16°
*      10     3.548e+02  3.469e-05  2.443e-07   -118.00°   -202.61°
*   Total Harmonic Distortion: 0.004591%(0.000000%)
*   N-Period=5
*   Fourier components of V(splout_v)
*   DC component:3.52651e-005
*   Harmonic  Frequency   Fourier   Normalized   Phase    Normalized
*    Number     [Hz]     Component   Component  [degree]  Phase [deg]
*       1     4.340e+01  2.146e+02  1.000e+00     83.35°      0.00°
*       2     8.680e+01  1.859e-03  8.664e-06    -28.80°   -112.15°
*       3     1.302e+02  5.464e-01  2.547e-03     37.44°    -45.91°
*       4     1.736e+02  8.562e-04  3.991e-06    112.86°     29.51°
*       5     2.170e+02  2.710e-01  1.263e-03    140.61°     57.25°
*       6     2.604e+02  1.416e-04  6.600e-07    154.54°     71.19°
*       7     3.038e+02  1.124e-01  5.237e-04    -96.68°   -180.03°
*       8     3.472e+02  3.746e-04  1.746e-06     11.74°    -71.61°
*       9     3.906e+02  4.029e-02  1.878e-04     63.94°    -19.41°
*      10     4.340e+02  1.102e-04  5.135e-07     38.89°    -44.46°
*   Total Harmonic Distortion: 0.289694%(0.289478%)